# EAGLE design SOIC20_v2r1_final (EAGLE 9.4.2)
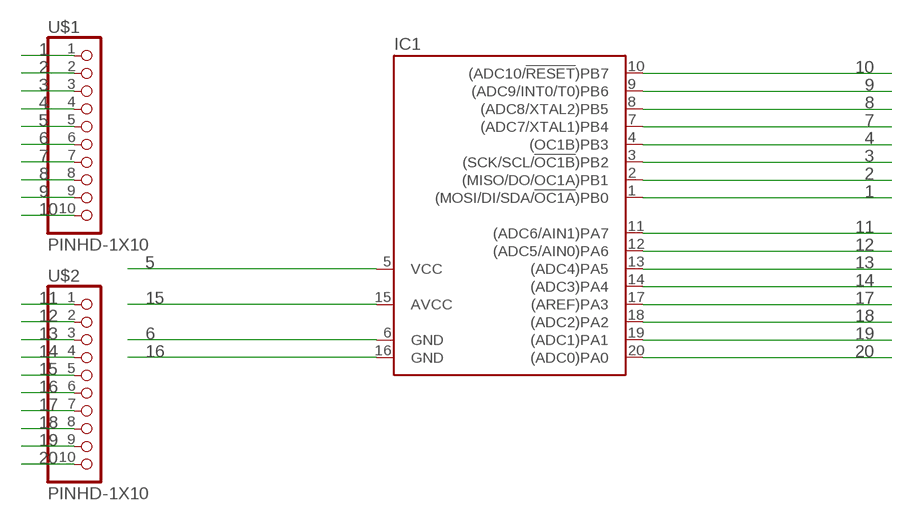
[diagram p0: schematic, sheet 1]

## Parts
IC1  TINY26LS  [SO20L]
U$1  PINHD-1X10  [1X10-BIG]
U$2  PINHD-1X10  [1X10-BIG]

## Nets
1: IC1.1((MOSI/DI/SDA/!OC1A!)PB0) U$1.1
2: IC1.2((MISO/DO/OC1A)PB1) U$1.2
3: IC1.3((SCK/SCL/!OC1B!)PB2) U$1.3
4: IC1.4((OC1B)PB3) U$1.4
5: IC1.5(VCC) U$1.5
6: IC1.6(GND) U$1.6
7: IC1.7((ADC7/XTAL1)PB4) U$1.7
8: IC1.8((ADC8/XTAL2)PB5) U$1.8
9: IC1.9((ADC9/INT0/T0)PB6) U$1.9
10: IC1.10((ADC10/!RESET!)PB7) U$1.10
11: IC1.11((ADC6/AIN1)PA7) U$2.1
12: IC1.12((ADC5/AIN0)PA6) U$2.2
13: IC1.13((ADC4)PA5) U$2.3
14: IC1.14((ADC3)PA4) U$2.4
15: IC1.15(AVCC) U$2.5
16: IC1.16(GND) U$2.6
17: IC1.17((AREF)PA3) U$2.7
18: IC1.18((ADC2)PA2) U$2.8
19: IC1.19((ADC1)PA1) U$2.9
20: IC1.20((ADC0)PA0) U$2.10

## Library data of the parts
IC1 = atmel:TINY26*: 8-bit AVR Microcontroller with 2K Bytes Flash Source: http://www.atmel.com .. doc1477.pdf; MPN: ATTINY26L-8SU; OC_FARNELL: 9171665; OC_NEWARK: 01M6921
U$1 U$2 = adafruit:PINHD-1X10: Pin header 1x10 0.1" spacing With round pins

## Board
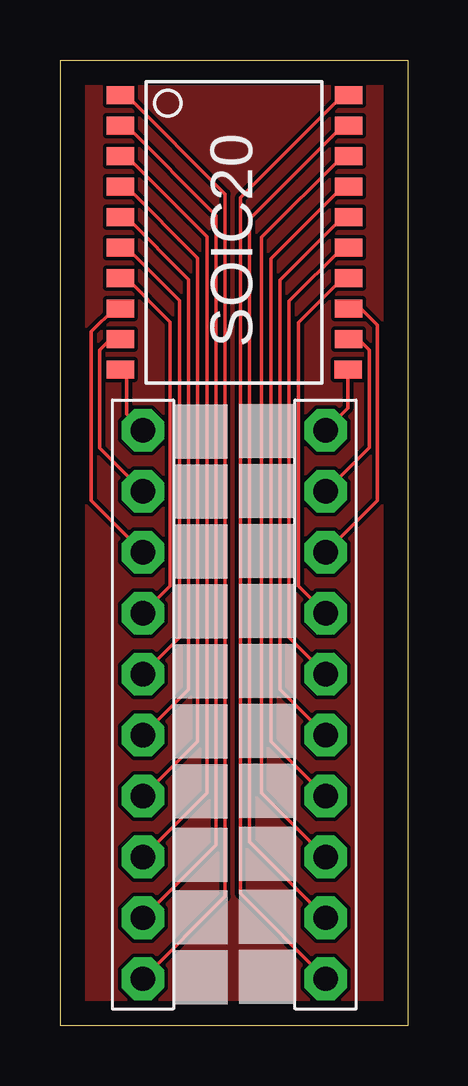
[diagram p1: board, top side]
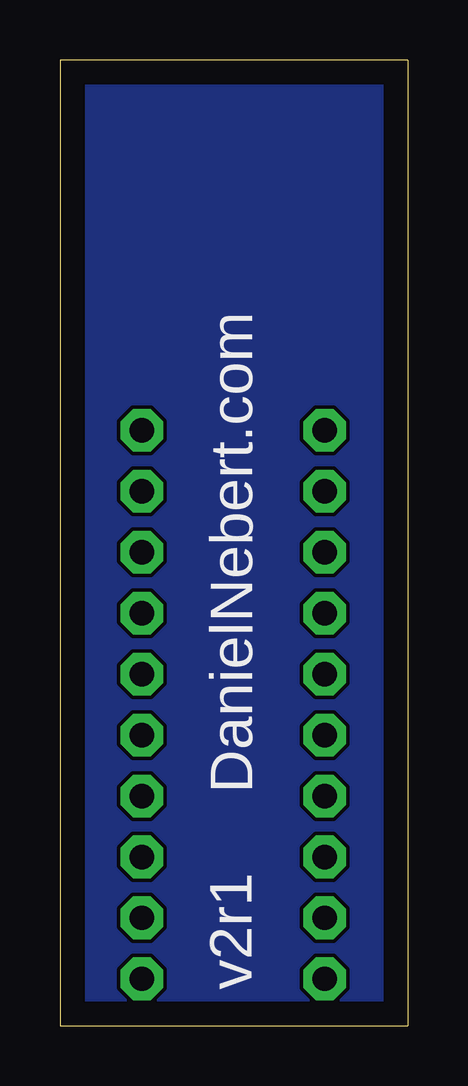
[diagram p2: board, bottom side, seen from below]

Size 14.5 x 40.25 mm. Coordinates in mm from the lower left corner, seen from the top.
Outline: 0,40.25 0,0 14.5,0 14.5,40.25 0,40.25
Copper layers (1*16): Top 0.035mm / dielectric 1.5mm / Bottom 0.035mm
Design rules "default": minimum track width 6mil, minimum drill 0.35mm, track to track 6mil, track to pad 6mil, pad to pad 6mil, via to via 6mil, smd to smd 6mil, copper to edge 40mil, drill to drill 6mil, minimum pad ring 10mil, minimum via ring 8mil, stop-mask expansion 4mil, vias tented up to drill 0mil, thermal gap 10mil

### Footprints (pad centres in the part's own frame; a part is rotated, then mirrored left to right if it is on the bottom)
SO20L = smd 0.762 x 1.143: 1 -5.08,-5.131; 2 -3.81,-5.131; 3 -2.54,-5.131; 4 -1.27,-5.131; 5 0,-5.131; 6 1.27,-5.131; 7 2.54,-5.131; 8 3.81,-5.131; 9 5.08,-5.131; 10 6.35,-5.131; 11 6.35,4.369; 12 5.08,4.394; 13 3.81,4.394; 14 2.54,4.394; 15 1.27,4.394; 16 0,4.394; 17 -1.27,4.394; 18 -2.54,4.394; 19 -3.81,4.394; 20 -5.08,4.394
1X10-BIG = drill 1.016 pad 1.778 octagon: 1 -11.43,0; 2 -8.89,0; 3 -6.35,0; 4 -3.81,0; 5 -1.27,0; 6 1.27,0; 7 3.81,0; 8 6.35,0; 9 8.89,0; 10 11.43,0

### Placement (x,y rotation side)
IC1  7.65,33.7 270 top
U$1  3.46,13.38 90 top
U$2  11.08,13.38 270 top

### Tracks (layer width: path | path; a pad name or v marks a point on that pad's centre or on a via)
1
  Top 0.152: U$1.1 6.89,5.38 6.89,34.66 2.77,38.78 IC1.1
2
  Top 0.152: IC1.2 2.77,37.51 6.51,33.77 6.51,7.54 U$1.2
3
  Top 0.152: U$1.3 6.13,9.7 6.13,32.88 2.77,36.24 IC1.3
4
  Top 0.152: IC1.4 2.77,34.97 5.75,31.99 5.75,11.85 U$1.4
5
  Top 0.152: U$1.5 5.37,14.01 5.37,31.1 2.77,33.7 IC1.5
6
  Top 0.152: IC1.6 2.77,32.43 4.99,30.21 4.99,16.17 U$1.6
7
  Top 0.152: IC1.7 2.77,31.16 4.6,29.32 4.6,18.33 U$1.7
8
  Top 0.152: IC1.8 2.27,29.89 1.3,28.92 1.3,21.89 U$1.8
9
  Top 0.152: IC1.9 2.12,28.62 1.66,28.16 1.66,24.07 U$1.9
10
  Top 0.152: IC1.10 2.78,27.09 2.78,25.49 U$1.10
11
  Top 0.152: IC1.11 12.02,25.75 U$2.1
12
  Top 0.152: IC1.12 12.44,28.62 12.9,28.16 12.9,24.09 U$2.2
13
  Top 0.152: IC1.13 12.55,29.89 13.24,29.19 13.24,21.89 U$2.3
14
  Top 0.152: IC1.14 11.8,31.16 9.94,29.3 9.94,18.33 U$2.4
15
  Top 0.152: IC1.15 11.8,32.43 9.56,30.19 9.56,16.17 U$2.5
16
  Top 0.152: U$2.6 9.18,14.01 9.18,31.08 11.8,33.7 IC1.16
17
  Top 0.152: IC1.17 11.8,34.97 8.79,31.97 8.79,11.85 U$2.7
18
  Top 0.152: U$2.8 8.41,9.7 8.41,32.86 11.8,36.24 IC1.18
19
  Top 0.152: IC1.19 11.8,37.51 7.91,33.62 7.91,7.66 U$2.9
20
  Top 0.152: U$2.10 7.53,5.5 7.53,34.51 11.8,38.78 IC1.20
GND
  pour Top: 0,0 14.5,0 14.5,40.25 0,40.25
  pour Bottom: 0,0 14.5,0 14.5,3.25 14.5,40.25 11,40.25 0,40.25 0,36

### Text on the board
tPlace: SOIC20
bPlace: DanielNebert.com | v2r1